# EAGLE schematic barcodescanner (EAGLE 7.3.0)
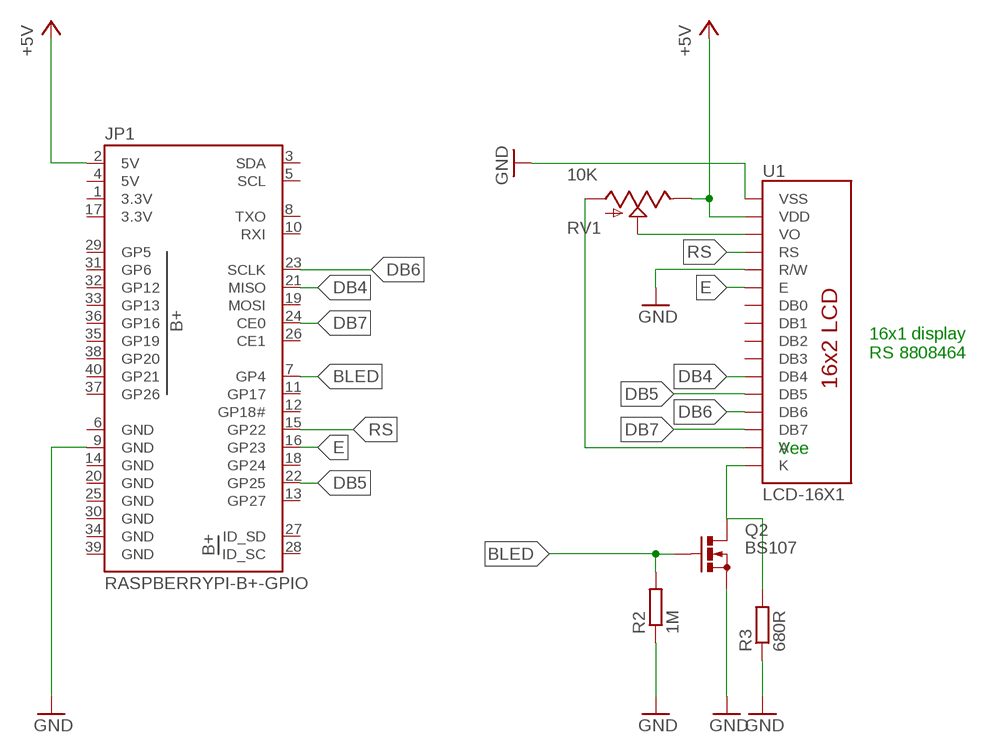
[diagram p0: schematic, sheet 1]

## Parts
JP1  RASPBERRYPI-B+-GPIO  [2X20-SHROUDED]
Q2  BS107  BS170  [SOT54E]
R2  1M  R-EU_0204/7  [0204/7]
R3  680R  R-EU_0204/7  [0204/7]
RV1  10K  POT  [ALPS_POT]
U1  LCD-16X1  LCD-16X2NOHOLES  [LCD-16X2_NOHOLES]

## Nets
+5V: JP1.2(5V) RV1.P$1(E) U1.2(VDD)
BLED: JP1.7(GP4) Q2.G R2.2
DB4: JP1.21(MISO) U1.11(DB4)
DB5: JP1.22(GP25) U1.12(DB5)
DB6: JP1.23(SCLK) U1.13(DB6)
DB7: JP1.24(CE0) RV1.P$3(A) U1.14(DB7) U1.15(A)
E: JP1.16(GP23) U1.6(E)
GND: JP1.9(GND) Q2.S R2.1 R3.1 U1.1(VSS) U1.5(R/W)
N$2: RV1.P$2(S) U1.3(VO)
N$6: Q2.D R3.2 U1.16(K)
RS: JP1.15(GP22) U1.4(RS)
Unconnected: JP1.3(SDA) JP1.5(SCL) JP1.8(TXO) JP1.10(RXI) JP1.11(GP17) JP1.12(GP18#) JP1.13(GP27) JP1.18(GP24) JP1.19(MOSI) JP1.26(CE1) JP1.27(ID_SD) JP1.28(ID_SC) JP1.29(GP5) JP1.31(GP6) JP1.32(GP12) JP1.33(GP13) JP1.35(GP19) JP1.36(GP16) JP1.37(GP26) JP1.38(GP20) JP1.40(GP21) U1.7(DB0) U1.8(DB1) U1.9(DB2) U1.10(DB3)

## Notes on the sheet
- 16x1 display
  RS 8808464
- Vee

## Power pins joined to a net without a drawn wire
3.3V: JP1.1(3.3V) JP1.17(3.3V)
5V: JP1.4(5V)
GND: JP1.6(GND) JP1.14(GND) JP1.20(GND) JP1.25(GND) JP1.30(GND) JP1.34(GND) JP1.39(GND)

## Library data of the parts
JP1 = SparkFun-Boards:RASPBERRYPI-B+-GPIO: Raspberry Pi B+ GPIO Header 2x20 pin connector
Q2 = transistor-small-signal:BS170: N-CHANNEL MOS FET
R2 R3 = resistor:R-EU_: RESISTOR, European symbol
RV1 = SparkFun-Electromechanical:POT; PROD_ID: RES-09177
U1 = SparkFun-Displays:LCD-16X2: Standard text-only 16x2 parallel input LCD